# EAGLE schematic SteppyMk2 (EAGLE 9.2.2)
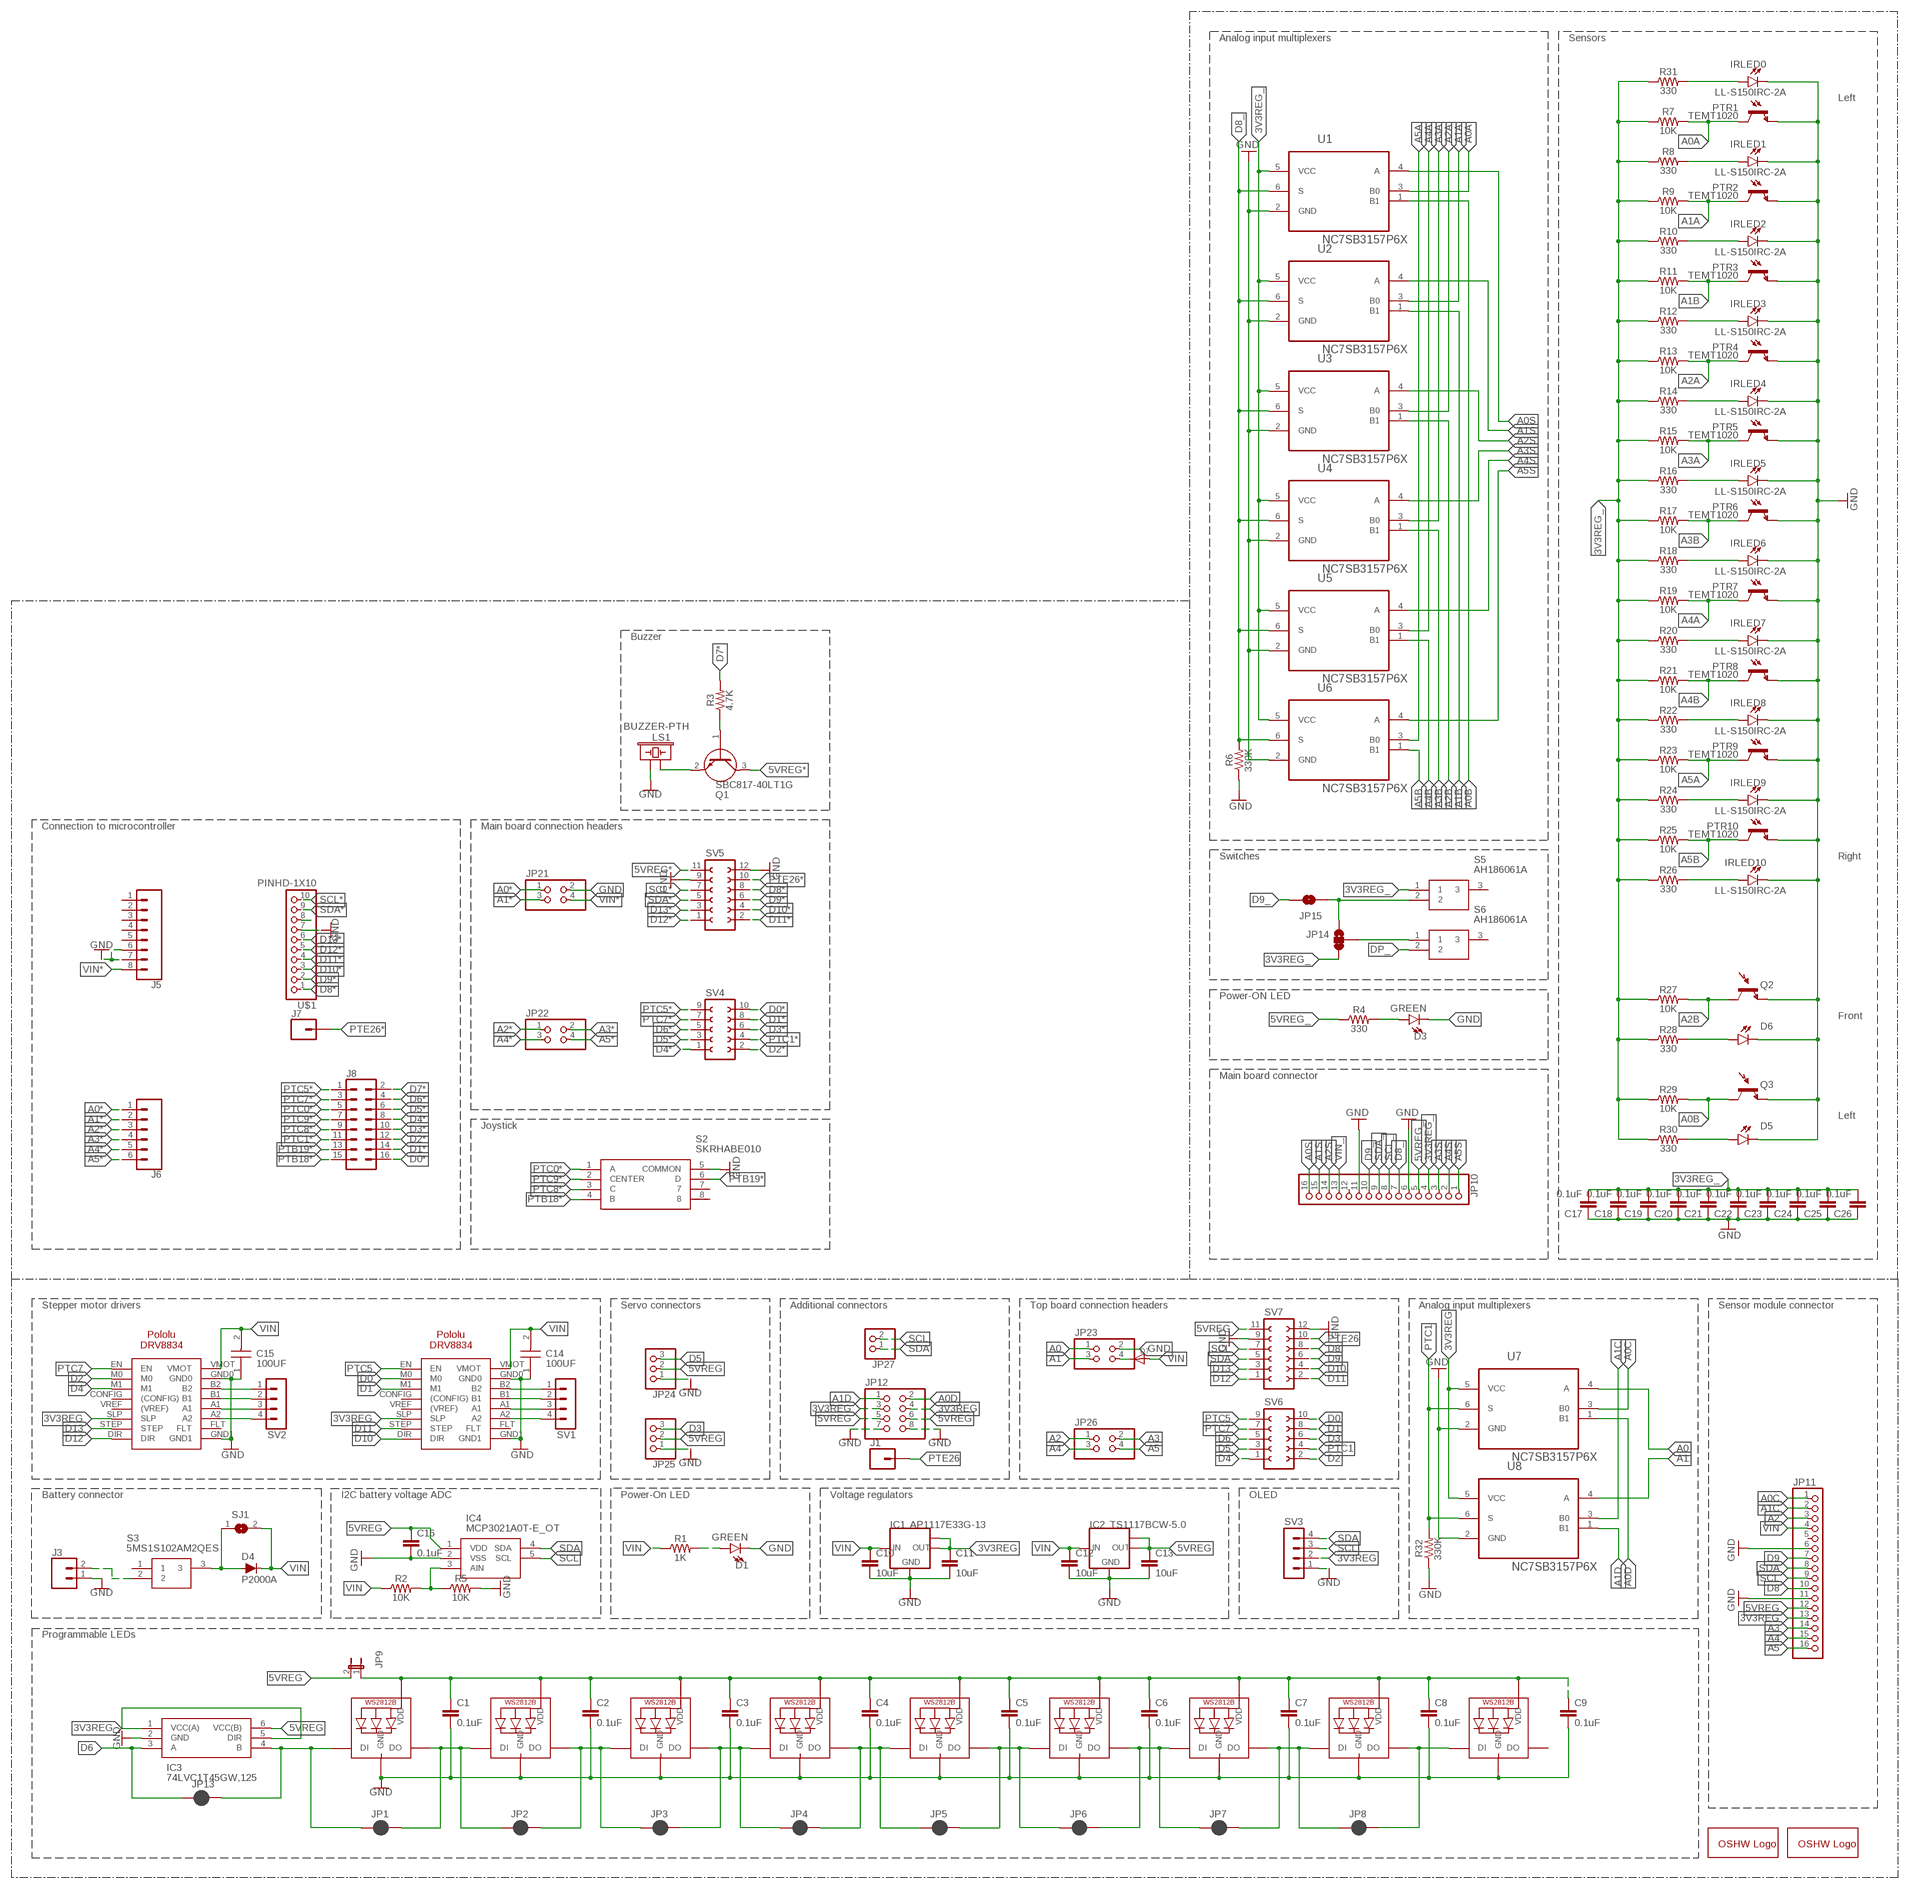
[diagram p0: schematic, sheet 1]

## Parts
C1  0.1uF  0.1UF-0603-25V-5%  [0603]
C2  0.1uF  0.1UF-0603-25V-5%  [0603]
C3  0.1uF  0.1UF-0603-25V-5%  [0603]
C4  0.1uF  0.1UF-0603-25V-5%  [0603]
C5  0.1uF  0.1UF-0603-25V-5%  [0603]
C6  0.1uF  0.1UF-0603-25V-5%  [0603]
C7  0.1uF  0.1UF-0603-25V-5%  [0603]
C8  0.1uF  0.1UF-0603-25V-5%  [0603]
C9  0.1uF  0.1UF-0603-25V-5%  [0603]
C10  10uF  10UF-0805-10V-10%  [0805]
C11  10uF  10UF-0805-10V-10%  [0805]
C12  10uF  10UF-0805-10V-10%  [0805]
C13  10uF  10UF-0805-10V-10%  [0805]
C14  100UF  EEEFK1C101P  [CAPM7058X610N]
C15  100UF  EEEFK1C101P  [CAPM7058X610N]
C16  0.1uF  0.1UF-0603-25V-5%  [0603]
C17  0.1uF  0.1UF-0603-25V-5%  [0603]
C18  0.1uF  0.1UF-0603-25V-5%  [0603]
C19  0.1uF  0.1UF-0603-25V-5%  [0603]
C20  0.1uF  0.1UF-0603-25V-5%  [0603]
C21  0.1uF  0.1UF-0603-25V-5%  [0603]
C22  0.1uF  0.1UF-0603-25V-5%  [0603]
C23  0.1uF  0.1UF-0603-25V-5%  [0603]
C24  0.1uF  0.1UF-0603-25V-5%  [0603]
C25  0.1uF  0.1UF-0603-25V-5%  [0603]
C26  0.1uF  0.1UF-0603-25V-5%  [0603]
CONLEFT  POLOLU-DRV8825  [POLOLU-DRV8825]
D1  GREEN  LED-GREEN1206  [LED-1206]
D3  GREEN  LED-GREEN1206  [LED-1206]
D4  P2000A  DIODE-PTH  [DIODE-1N4001]
D5  LED-IRSIDE_EMITTER  [LTE-302]
D6  LED-IRSIDE_EMITTER  [LTE-302]
D7  DIODESMA  [SMADIODE]
GOLD_ORB_SM1  OSHWLOGOLOGO8MM  [OSHW_8MM]
GOLD_ORB_SM2  OSHWLOGOLOGO5MM  [OSHW_5MM]
IC1  AP1117E33G-13  LM1117IMPX-3.3  [SOT223]
IC2  TS1117BCW-5.0  LM1117IMPX-5.0  [SOT223]
IC3  74LVC1T45GW,125  [SOT65P210X110-6N]
IC4  MCP3021A0T-E_OT  [SOT95P280X145-5N]
IRLED0  LL-S150IRC-2A  PT15-21C_TR8  [LEDC3215X130N]
IRLED1  LL-S150IRC-2A  PT15-21C_TR8  [LEDC3215X130N]
IRLED2  LL-S150IRC-2A  PT15-21C_TR8  [LEDC3215X130N]
IRLED3  LL-S150IRC-2A  PT15-21C_TR8  [LEDC3215X130N]
IRLED4  LL-S150IRC-2A  PT15-21C_TR8  [LEDC3215X130N]
IRLED5  LL-S150IRC-2A  PT15-21C_TR8  [LEDC3215X130N]
IRLED6  LL-S150IRC-2A  PT15-21C_TR8  [LEDC3215X130N]
IRLED7  LL-S150IRC-2A  PT15-21C_TR8  [LEDC3215X130N]
IRLED8  LL-S150IRC-2A  PT15-21C_TR8  [LEDC3215X130N]
IRLED9  LL-S150IRC-2A  PT15-21C_TR8  [LEDC3215X130N]
IRLED10  LL-S150IRC-2A  PT15-21C_TR8  [LEDC3215X130N]
J1  CONN_01  [1X01]
J3  CONN_02  [1X02]
J5  CONN_08"  [1X08]
J6  CONN_06SILK_FEMALE_PTH  [1X06]
J7  CONN_01  [1X01]
J8  CONN_08X2_HEADER  [2X8]
JP1  JUMPER-SMT_2_NC_PASTE_SILK  [SMT-JUMPER_2_NC_PASTE_SILK]
JP2  JUMPER-SMT_2_NC_PASTE_SILK  [SMT-JUMPER_2_NC_PASTE_SILK]
JP3  JUMPER-SMT_2_NC_PASTE_SILK  [SMT-JUMPER_2_NC_PASTE_SILK]
JP4  JUMPER-SMT_2_NC_PASTE_SILK  [SMT-JUMPER_2_NC_PASTE_SILK]
JP5  JUMPER-SMT_2_NC_PASTE_SILK  [SMT-JUMPER_2_NC_PASTE_SILK]
JP6  JUMPER-SMT_2_NC_PASTE_SILK  [SMT-JUMPER_2_NC_PASTE_SILK]
JP7  JUMPER-SMT_2_NC_PASTE_SILK  [SMT-JUMPER_2_NC_PASTE_SILK]
JP8  JUMPER-SMT_2_NC_PASTE_SILK  [SMT-JUMPER_2_NC_PASTE_SILK]
JP9  JP1E  [JP1]
JP10  PINHD-1X16/90  [1X16/90]
JP11  PINHD-1X16  [1X16]
JP12  PINHD-2X4  [2X04]
JP13  JUMPER-SMT_2_NC_PASTE_SILK  [SMT-JUMPER_2_NC_PASTE_SILK]
JP14  JUMPER-SMT_3_1-NC_TRACE_SILK  [SMT-JUMPER_3_1-NC_TRACE_SILK]
JP15  JUMPER-SMT_2_NC_TRACE_SILK  [SMT-JUMPER_2_NC_TRACE_SILK]
JP21  PINHD-2X2  [2X02]
JP22  PINHD-2X2  [2X02]
JP23  PINHD-2X2  [2X02]
JP24  PINHD-1X3  [1X03]
JP25  PINHD-1X3  [1X03]
JP26  PINHD-2X2  [2X02]
JP27  PINHD-1X2  [1X02]
LED1  WS2812B3535  [LED3535]
LED2  WS2812B3535  [LED3535]
LED3  WS2812B3535  [LED3535]
LED4  WS2812B3535  [LED3535]
LED5  WS2812B3535  [LED3535]
LED6  WS2812B3535  [LED3535]
LED7  WS2812B3535  [LED3535]
LED8  WS2812B3535  [LED3535]
LED9  WS2812B3535  [LED3535]
LS1  BUZZER-PTH  [BUZZER-12MM]
PTR1  TEMT1020  [TEMT1020]
PTR2  TEMT1020  [TEMT1020]
PTR3  TEMT1020  [TEMT1020]
PTR4  TEMT1020  [TEMT1020]
PTR5  TEMT1020  [TEMT1020]
PTR6  TEMT1020  [TEMT1020]
PTR7  TEMT1020  [TEMT1020]
PTR8  TEMT1020  [TEMT1020]
PTR9  TEMT1020  [TEMT1020]
PTR10  TEMT1020  [TEMT1020]
Q1  SBC817-40LT1G  [SOT96P237X111-3N]
Q2  LTR-301  [LTR-301]
Q3  LTR-301  [LTR-301]
R1  1K  RESISTOR0805  [0805]
R2  10K  RESISTOR0805  [0805]
R3  4.7K  RESISTOR0805  [0805]
R4  330  RESISTOR0805  [0805]
R5  10K  RESISTOR0805  [0805]
R6  330K  RESISTOR0805  [0805]
R7  10K  RESISTOR0805  [0805]
R8  330  RESISTOR0805  [0805]
R9  10K  RESISTOR0805  [0805]
R10  330  RESISTOR0805  [0805]
R11  10K  RESISTOR0805  [0805]
R12  330  RESISTOR0805  [0805]
R13  10K  RESISTOR0805  [0805]
R14  330  RESISTOR0805  [0805]
R15  10K  RESISTOR0805  [0805]
R16  330  RESISTOR0805  [0805]
R17  10K  RESISTOR0805  [0805]
R18  330  RESISTOR0805  [0805]
R19  10K  RESISTOR0805  [0805]
R20  330  RESISTOR0805  [0805]
R21  10K  RESISTOR0805  [0805]
R22  330  RESISTOR0805  [0805]
R23  10K  RESISTOR0805  [0805]
R24  330  RESISTOR0805  [0805]
R25  10K  RESISTOR0805  [0805]
R26  330  RESISTOR0805  [0805]
R27  10K  RESISTOR0805  [0805]
R28  330  RESISTOR0805  [0805]
R29  10K  RESISTOR0805  [0805]
R30  330  RESISTOR0805  [0805]
R31  330  RESISTOR0805  [0805]
R32  330K  RESISTOR0805  [0805]
S2  SKRHABE010  [SKRHABE010]
S3  5MS1S102AM2QES  [5MS1S102AM2QES]
S5  AH186061A  [AH186061A]
S6  AH186061A  [AH186061A]
SJ1  SJW  [SJW]
SV1  MA04-1  [MA04-1]
SV2  MA04-1  [MA04-1]
SV3  MA04-1  [MA04-1]
SV4  FE05-2  [FE05-2]
SV5  FE06-2  [FE06-2]
SV6  FE05-2  [FE05-2]
SV7  FE06-2  [FE06-2]
U1  NC7SB3157P6X  [SOT65P210X110-6N]
U2  NC7SB3157P6X  [SOT65P210X110-6N]
U3  NC7SB3157P6X  [SOT65P210X110-6N]
U4  NC7SB3157P6X  [SOT65P210X110-6N]
U5  NC7SB3157P6X  [SOT65P210X110-6N]
U6  NC7SB3157P6X  [SOT65P210X110-6N]
U7  NC7SB3157P6X  [SOT65P210X110-6N]
U8  NC7SB3157P6X  [SOT65P210X110-6N]
U$1  PINHD-1X10  [1X10-BIG]
U$2  POLOLU-DRV8825  [POLOLU-DRV8825]

## Nets
3V3REG: C11.1 CONLEFT.SLP IC1.2(OUT) IC1.TAB(OUT1) IC3.1(VCC(A)) IC3.5(DIR) JP11.13 JP12.3 JP12.4 SV3.2 U7.5(VCC) U8.5(VCC) U$2.SLP
3V3REG_: C17.2 C18.2 C19.2 C20.2 C21.2 C22.2 C23.2 C24.2 C25.2 C26.2 JP10.4 JP14.3 R7.1 R8.1 R9.1 R10.1 R11.1 R12.1 R13.1 R14.1 R15.1 R16.1 R17.1 R18.1 R19.1 R20.1 R21.1 R22.1 R23.1 R24.1 R25.1 R26.1 R27.1 R28.1 R29.1 R30.1 R31.1 S5.1 U1.5(VCC) U2.5(VCC) U3.5(VCC) U4.5(VCC) U5.5(VCC) U6.5(VCC)
5VREG: C13.1 C16.1 IC2.2(OUT) IC2.TAB(OUT1) IC3.6(VCC(B)) IC4.1(VDD) JP9.2 JP11.12 JP12.5 JP12.6 JP24.2 JP25.2 SV7.11
5VREG*: Q1.3(C) SV5.11
5VREG_: JP10.5 R4.1
A0: JP23.1 U7.4(A)
A0*: J6.1 JP21.1
A0A: PTR1.1(C) R7.2 U1.3(B0)
A0B: Q3.C(C1) R29.2 U1.1(B1)
A0C: JP11.1 U7.3(B0)
A0D: JP12.2 U7.1(B1)
A0S: JP10.16 U1.4(A)
A1: JP23.3 U8.4(A)
A1*: J6.2 JP21.3
A1A: PTR2.1(C) R9.2 U2.3(B0)
A1B: PTR3.1(C) R11.2 U2.1(B1)
A1C: JP11.2 U8.3(B0)
A1D: JP12.1 U8.1(B1)
A1S: JP10.15 U2.4(A)
A2: JP11.3 JP26.1
A2*: J6.3 JP22.1
A2A: PTR4.1(C) R13.2 U3.3(B0)
A2B: Q2.C(C1) R27.2 U3.1(B1)
A2S: JP10.14 U3.4(A)
A3: JP11.14 JP26.2
A3*: J6.4 JP22.2
A3A: PTR5.1(C) R15.2 U4.3(B0)
A3B: PTR6.1(C) R17.2 U4.1(B1)
A3S: JP10.3 U4.4(A)
A4: JP11.15 JP26.3
A4*: J6.5 JP22.3
A4A: PTR7.1(C) R19.2 U5.3(B0)
A4B: PTR8.1(C) R21.2 U5.1(B1)
A4S: JP10.2 U5.4(A)
A5: JP11.16 JP26.4
A5*: J6.6 JP22.4
A5A: PTR9.1(C) R23.2 U6.3(B0)
A5B: PTR10.1(C) R25.2 U6.1(B1)
A5S: JP10.1 U6.4(A)
D0: SV6.10 U$2.M0
D0*: J8.16 SV4.10
D1: SV6.8 U$2.M1
D1*: J8.14 SV4.8
D2: CONLEFT.M0 SV6.2
D2*: J8.12 SV4.2
D3: JP25.3 SV6.6
D3*: J8.10 SV4.6
D4: CONLEFT.M1 SV6.1
D4*: J8.8 SV4.1
D5: JP24.3 SV6.3
D5*: J8.6 SV4.3
D6: IC3.3(A) JP13.1 SV6.5
D6*: J8.4 SV4.5
D7*: J8.2 R3.2
D8: JP11.10 SV7.8
D8*: SV5.8 U$1.1
D8_: JP10.7 R6.2 U1.6(S) U2.6(S) U3.6(S) U4.6(S) U5.6(S) U6.6(S)
D9: JP11.7 SV7.6
D9*: SV5.6 U$1.2
D9_: JP10.10 JP15.1
D10: SV7.4 U$2.DIR
D10*: SV5.4 U$1.3
D11: SV7.2 U$2.STEP
D11*: SV5.2 U$1.4
D12: CONLEFT.DIR SV7.1
D12*: SV5.1 U$1.5
D13: CONLEFT.STEP SV7.3
D13*: SV5.3 U$1.6
DP_: S6.2
GND: C1.2 C2.2 C3.2 C4.2 C5.2 C6.2 C7.2 C8.2 C9.2 C10.2 C11.2 C12.2 C13.2 C14.1 C15.1 C16.2 C17.1 C18.1 C19.1 C20.1 C21.1 C22.1 C23.1 C24.1 C25.1 C26.1 CONLEFT.GND0 CONLEFT.GND1 D1.C D3.C D5.C D6.C IC1.1(GND) IC2.1(GND) IC3.2(GND) IC4.2(VSS) IRLED0.2(C) IRLED1.2(C) IRLED2.2(C) IRLED3.2(C) IRLED4.2(C) IRLED5.2(C) IRLED6.2(C) IRLED7.2(C) IRLED8.2(C) IRLED9.2(C) IRLED10.2(C) J3.1 J5.6 J5.7 JP10.6 JP10.11 JP11.6 JP11.11 JP12.7 JP12.8 JP21.2 JP23.2 JP24.1 JP25.1 LED1.4(GND) LED2.4(GND) LED3.4(GND) LED4.4(GND) LED5.4(GND) LED6.4(GND) LED7.4(GND) LED8.4(GND) LED9.4(GND) LS1.- PTR1.2(E) PTR2.2(E) PTR3.2(E) PTR4.2(E) PTR5.2(E) PTR6.2(E) PTR7.2(E) PTR8.2(E) PTR9.2(E) PTR10.2(E) Q2.E(E1) Q3.E(E1) R5.2 R6.1 R32.1 S2.5(COMMON) SV3.1 SV5.9 SV5.12 SV7.9 SV7.12 U1.2(GND) U2.2(GND) U3.2(GND) U4.2(GND) U5.2(GND) U6.2(GND) U7.2(GND) U8.2(GND) U$1.7 U$2.GND0 U$2.GND1
N$1: IRLED8.1(A) R22.2
N$2: IRLED1.1(A) R8.2
N$3: D6.A R28.2
N$4: D7.C JP23.4
N$5: JP14.2 S6.1
N$6: IRLED0.1(A) R31.2
N$7: IC3.4(B) JP1.1 JP13.2 LED1.1(DI)
N$8: JP2.2 JP3.1 LED2.3(DO) LED3.1(DI)
N$9: JP3.2 JP4.1 LED3.3(DO) LED4.1(DI)
N$10: JP4.2 JP5.1 LED4.3(DO) LED5.1(DI)
N$11: JP5.2 JP6.1 LED5.3(DO) LED6.1(DI)
N$12: JP6.2 JP7.1 LED6.3(DO) LED7.1(DI)
N$13: IRLED2.1(A) R10.2
N$14: JP7.2 JP8.1 LED7.3(DO) LED8.1(DI)
N$15: JP8.2 LED8.3(DO) LED9.1(DI)
N$16: D1.A R1.2
N$17: SV1.1 U$2.B2
N$18: SV1.2 U$2.B1
N$19: SV1.3 U$2.A1
N$20: SV1.4 U$2.A2
N$21: D5.A R30.2
N$23: D3.A R4.2
N$24: IRLED3.1(A) R12.2
N$25: U$1.8
N$27: CONLEFT.B2 SV2.1
N$28: CONLEFT.B1 SV2.2
N$29: CONLEFT.A1 SV2.3
N$30: CONLEFT.A2 SV2.4
N$31: J3.2 S3.2
N$33: LS1.+ Q1.2(E)
N$34: Q1.1(B) R3.1
N$35: IC4.3(AIN) R2.2 R5.1
N$45: C1.1 C2.1 C3.1 C4.1 C5.1 C6.1 C7.1 C8.1 C9.1 JP9.1 LED1.2(VDD) LED2.2(VDD) LED3.2(VDD) LED4.2(VDD) LED5.2(VDD) LED6.2(VDD) LED7.2(VDD) LED8.2(VDD) LED9.2(VDD)
N$47: IRLED4.1(A) R14.2
N$51: IRLED5.1(A) R16.2
N$55: IRLED6.1(A) R18.2
N$59: IRLED7.1(A) R20.2
N$68: IRLED9.1(A) R24.2
N$69: JP14.1 JP15.2 S5.2
N$73: IRLED10.1(A) R26.2
N$85: JP1.2 JP2.1 LED1.3(DO) LED2.1(DI)
N$86: D4.A S3.3 SJ1.1
PTB18*: J8.15 S2.4(B)
PTB19*: J8.13 S2.6(D)
PTC0*: J8.5 S2.1(A)
PTC1: R32.2 SV6.4 U7.6(S) U8.6(S)
PTC1*: J8.11 SV4.4
PTC5: SV6.9 U$2.EN
PTC5*: J8.1 SV4.9
PTC7: CONLEFT.EN SV6.7
PTC7*: J8.3 SV4.7
PTC8*: J8.9 S2.3(C)
PTC9*: J8.7 S2.2(CENTER)
PTE26: J1.1 SV7.10
PTE26*: J7.1 SV5.10
SCL: IC4.5(SCL) JP11.9 JP27.2 SV3.3 SV7.7
SCL*: SV5.7 U$1.10
SCL_: JP10.8
SDA: IC4.4(SDA) JP11.8 JP27.1 SV3.4 SV7.5
SDA*: SV5.5 U$1.9
SDA_: JP10.9
VIN: C10.1 C12.1 C14.2 C15.2 CONLEFT.VMOT D4.C D7.A IC1.3(IN) IC2.3(IN) JP11.4 R1.1 R2.1 SJ1.2 U$2.VMOT
VIN*: J5.8 JP21.4
VIN_: JP10.13
Unconnected: CONLEFT.CONFIG((CONFIG)) CONLEFT.FLT CONLEFT.VREF((VREF)) J5.1 J5.2 J5.3 J5.4 J5.5 JP10.12 JP11.5 LED9.3(DO) S2.7 S2.8 S3.1 S5.3 S6.3 U$2.CONFIG((CONFIG)) U$2.FLT U$2.VREF((VREF))

## Notes on the sheet
- Analog input multiplexers | Sensors
- Left
- Buzzer
- Connection to microcontroller | Main board connection headers
- Switches | Right
- Power-ON LED
- Front
- Main board connector
- Left
- Joystick
- Stepper motor drivers | Servo connectors | Additional connectors | Top board connection headers | Analog input multiplexers | Sensor module connector
- Battery connector | I2C battery voltage ADC | Power-On LED | Voltage regulators | OLED
- Programmable LEDs

## Library data of the parts
C1-C9 C16-C26 = SparkFun-Capacitors:0.1UF: 0.1µF ceramic capacitors A capacitor is a passive two-terminal electrical component used to store electrical energy temporarily in an electric field.; PROD_ID: CAP-08604
C10-C13 = SparkFun-Capacitors:10UF: 10.0µF ceramic capacitors A capacitor is a passive two-terminal electrical component used to store electrical energy temporarily in an electric field.; PROD_ID: CAP-11330
C14 C15 = EEEFK1C101P:EEEFK1C101P: Ecap 100uF 16V D case Panasonic 100uF 16 V dc Aluminium Electrolytic Capacitor, FK SMD Series 2000h 6.3 Dia. x 5.8mm Source: Datasheet <http://uk.rs-online.com/web/p/products/5370433>; ALLIED_NUMBER: 70256494; ALLIED_PRICE-STOCK: https://www.alliedelec.com/panasonic-eee-fk1c101p/70256494/; DESCRIPTION: Ecap 100uF 16V D case Panasonic 100uF 16 V dc Aluminium Electrolytic Capacitor, FK SMD Series 2000h 6.3 Dia. x 5.8mm; HEIGHT: 6.1mm; MANUFACTURER_NAME: Panasonic; MANUFACTURER_PART_NUMBER: EEEFK1C101P; RS_PART_NUMBER: 5370433P; RS_PRICE-STOCK: http://uk.rs-online.com/web/p/products/5370433P
CONLEFT U$2 = alvarop-lib:POLOLU-DRV8825
D1 D3 = SparkFun-LED:LED-GREEN: Green SMD LED Used in manufacturing of various products at SparkFun Packages: 0603 - SMD 0603 package [Product Link] <http://www.futureelectronics.com/en/technologies/semiconductors/optoelectronics/leds/Pages/9894312-LTST-C190GKT.aspx?CrossPart=HSMG-C190&IM=0> LilyPad 1206 - SMD1206 LilyPad package [Product Link] <http://www.futureelectronics.com/en/Technologies/Product.aspx?ProductID=IN150NGHARVATEKCORPORATION2049943&IM=0> 1206 - SMD1206 package [Product Link] <http://www.futureelectronics.com/en/technologies/semiconductors/optoelectronics/leds/Pages/8315665-LTST-C150KGKT.aspx?IM=0> 1206 Bottom Mount -SMD 1206 Bottom Mount [Product Link] <http://www.digikey.com/product-detail/en/lite-on-inc/LTST-C230KGKT/160-1456-1-ND/386854> SparkFun Products: Pro Mini 328 -5V <https://www.sparkfun.com/products/821> RedBoard <https://www.sparkfun.com/products/12757> MP3 Trigger <https://www.sparkfun.com/products/13720> Makey Makey <https://www.sparkfun.com/products/11076>; PROD_ID: DIO-00862
D4 = SparkFun-DiscreteSemi:DIODE: Diode; PROD_ID: DIO-09176; VALUE: 1A/50V/1.1V
D5 D6 = SparkFun-LED:LED-IR: Infrared LED (IR) Wavelength: 940nm Packages: TSAL6100 LTE302 - Side firing. Check SparkFun-Sensors.lbr for the receiver SparkFun Products: ZX Distance and Gesture Sensor <[https://www.sparkfun.com/products/12780]> Infrared Emitters and Detectors <https://www.sparkfun.com/products/241>; PROD_ID: DIO-14163; SF_ID: SEN-00241
D7 = adafruit:DIODE: Diode
GOLD_ORB_SM1 GOLD_ORB_SM2 = oshw:OSHWLOGO: The OSHW logo for PCB layout
IC1 IC2 = lm1117:LM1117IMPX-*
IC3 = 74LVC1T45GW_125:74LVC1T45GW,125: NXP - 74LVC1T45GW,125 - TRANSCEIVER, 3 STATE, SOT-363-6 Source: Datasheet <https://componentsearchengine.com/Datasheets/2/74LVC1T45GW,125.pdf>; DESCRIPTION: NXP - 74LVC1T45GW,125 - TRANSCEIVER, 3 STATE, SOT-363-6; HEIGHT: 1.1mm; MANUFACTURER_NAME: Nexperia; MANUFACTURER_PART_NUMBER: 74LVC1T45GW,125; MOUSER_PART_NUMBER: 771-74LVC1T45GW125; MOUSER_PRICE-STOCK: https://www.mouser.com/Search/Refine.aspx?Keyword=771-74LVC1T45GW125; RS_PART_NUMBER: 8168791P; RS_PRICE-STOCK: http://befr.rs-online.com/web/p/products/8168791P
IC4 = MCP3021A0T-E_OT:MCP3021A0T-E_OT: MICROCHIP - MCP3021A0T-E/OT - ADC, AEC-Q100, SAR, 10BIT, SOT-23-5 Source: Datasheet <http://ww1.microchip.com/downloads/en/DeviceDoc/20001805C.pdf>; ALLIED_NUMBER: 70451980; ALLIED_PRICE-STOCK: https://www.alliedelec.com/microchip-technology-inc-mcp3021a0t-e-ot/70451980/; DESCRIPTION: MICROCHIP - MCP3021A0T-E/OT - ADC, AEC-Q100, SAR, 10BIT, SOT-23-5; HEIGHT: 1.45mm; MANUFACTURER_NAME: Microchip; MANUFACTURER_PART_NUMBER: MCP3021A0T-E/OT; MOUSER_PART_NUMBER: 579-MCP3021A0T-E/OT; MOUSER_PRICE-STOCK: https://www.mouser.com/Search/Refine.aspx?Keyword=579-MCP3021A0T-E%2FOT
IRLED0 IRLED1-IRLED10 = PT15-21C_TR8:PT15-21C_TR8: Phototransistors IR Phototransistor Source: Datasheet <http://www.everlight.com/file/ProductFile/PT15-21C-TR8.pdf>; DESCRIPTION: Phototransistors IR Phototransistor; HEIGHT: 1.3mm; MANUFACTURER_NAME: Everlight; MANUFACTURER_PART_NUMBER: PT15-21C/TR8; MOUSER_PART_NUMBER: 638-PT1521CTR8; MOUSER_PRICE-STOCK: https://www.mouser.com/Search/Refine.aspx?Keyword=638-PT1521CTR8
J1 J7 = SparkFun-Connectors:CONN_01: Single connection point. Often used as Generic Header-pin footprint for 0.1 inch spaced/style header connections On any of the 0.1 inch spaced packages, you can populate with these: Break Away Headers - Straight <https://www.sparkfun.com/products/116> (PRT-00116) Break Away Male Headers - Right Angle <https://www.sparkfun.com/products/553> (PRT-00553) Female Headers <https://www.sparkfun.com/products/115> (PRT-00115) Break Away Headers - Machine Pin <https://www.sparkfun.com/products/117> (PRT-00117) Break Away Female Headers - Swiss Machine Pin <https://www.sparkfun.com/products/743> (PRT-00743) This device is also useful as a general connection point to wire up your design to another part of your project. Our various solder wires solder well into these plated through hole pads. Hook-Up Wire - Assortment (Stranded, 22 AWG) <https://www.sparkfun.com/products/11375> (PRT-11375) Hook-Up Wire - Assortment (Solid Core, 22 AWG) <https://www.sparkfun.com/products/11367> (PRT-11367) View the entire wire category on our website here <https://www.sparkfun.com/categories/141> Special notes: SMTSO-256-ET is a "flush mount" nut for a 4-40 screw. We mostly use this on specialty testbeds; it is a nice way to connect hardware to your PCB at an adjustable hieght. Also note, the SNAP packages are for using a snappable style connector. We sell a baggie of snaps and they are also used on two LilyPad designs: Snap Assortment - 30 pack (male and female) <https://www.sparkfun.com/products/11347> (DEV-11347) LilyPad Arduino SimpleSnap <https://www.sparkfun.com/products/10941> (DEV-10941) LilyPad SimpleSnap Protoboard <https://www.sparkfun.com/products/10940> (DEV-10940)
J3 = SparkFun-Connectors:CONN_02: Multi connection point. Often used as Generic Header-pin footprint for 0.1 inch spaced/style header connections On any of the 0.1 inch spaced packages, you can populate with these: Break Away Headers - Straight <https://www.sparkfun.com/products/116> (PRT-00116) Break Away Male Headers - Right Angle <https://www.sparkfun.com/products/553> (PRT-00553) Female Headers <https://www.sparkfun.com/products/115> (PRT-00115) Break Away Headers - Machine Pin <https://www.sparkfun.com/products/117> (PRT-00117) Break Away Female Headers - Swiss Machine Pin <https://www.sparkfun.com/products/743> (PRT-00743) For SCREWTERMINALS and SPRING TERMINALS visit here: Screw Terimnals on SparkFun.com <https://www.sparkfun.com/search/results?term=Screw+Terminals> (5mm/3.5mm/2.54mm spacing) This device is also useful as a general connection point to wire up your design to another part of your project. Our various solder wires solder well into these plated through hole pads. Hook-Up Wire - Assortment (Stranded, 22 AWG) <https://www.sparkfun.com/products/11375> (PRT-11375) Hook-Up Wire - Assortment (Solid Core, 22 AWG) <https://www.sparkfun.com/products/11367> (PRT-11367) View the entire wire category on our website here <https://www.sparkfun.com/categories/141> Special notes: Molex polarized connector foot print use with: PRT-08233 with associated crimp pins and housings. 2.54_SCREWTERM for use with PRT-10571. 3.5mm Screw Terminal footprints for PRT-08084 5mm Screw Terminal footprints for use with PRT-08432
J5 = SparkFun-Connectors:CONN_08: Multi connection point. Often used as Generic Header-pin footprint for 0.1 inch spaced/style header connections On any of the 0.1 inch spaced packages, you can populate with these: Break Away Headers - Straight <https://www.sparkfun.com/products/116> (PRT-00116) Break Away Male Headers - Right Angle <https://www.sparkfun.com/products/553> (PRT-00553) Female Headers <https://www.sparkfun.com/products/115> (PRT-00115) Break Away Headers - Machine Pin <https://www.sparkfun.com/products/117> (PRT-00117) Break Away Female Headers - Swiss Machine Pin <https://www.sparkfun.com/products/743> (PRT-00743) Arduino Stackable Header - 8 Pin <https://www.sparkfun.com/products/9279> (PRT-09279) For SCREWTERMINALS and SPRING TERMINALS visit here: Screw Terimnals on SparkFun.com <https://www.sparkfun.com/search/results?term=Screw+Terminals> (5mm/3.5mm/2.54mm spacing) This device is also useful as a general connection point to wire up your design to another part of your project. Our various solder wires solder well into these plated through hole pads. Hook-Up Wire - Assortment (Stranded, 22 AWG) <https://www.sparkfun.com/products/11375> (PRT-11375) Hook-Up Wire - Assortment (Solid Core, 22 AWG) <https://www.sparkfun.com/products/11367> (PRT-11367) View the entire wire category on our website here <https://www.sparkfun.com/categories/141> Special notes: Molex polarized connector foot print use with SKU : PRT-08231 with associated crimp pins and housings. 1MM SMD Version SKU: PRT-10208 NOTES ON THE VARIANTS LOCK and LOCK_LONGPADS... This footprint was designed to help hold the alignment of a through-hole component (i.e. 6-pin header) while soldering it into place. You may notice that each hole has been shifted either up or down by 0.005 of an inch from it's more standard position (which is a perfectly straight line). This slight alteration caused the pins (the squares in the middle) to touch the edges of the holes. Because they are alternating, it causes a "brace" to hold the component in place. 0.005 has proven to be the perfect amount of "off-center" position when using our standard breakaway headers. Although looks a little odd when you look at the bare footprint, once you have a header in there, the alteration is very hard to notice. Also,if you push a header all the way into place, it is covered up entirely on the bottom side.; PROD_ID: CONN-08438
J6 = SparkFun-Connectors:CONN_06: Multi connection point. Often used as Generic Header-pin footprint for 0.1 inch spaced/style header connections On any of the 0.1 inch spaced packages, you can populate with these: Break Away Headers - Straight <https://www.sparkfun.com/products/116> (PRT-00116) Break Away Male Headers - Right Angle <https://www.sparkfun.com/products/553> (PRT-00553) Female Headers <https://www.sparkfun.com/products/115> (PRT-00115) Break Away Headers - Machine Pin <https://www.sparkfun.com/products/117> (PRT-00117) Break Away Female Headers - Swiss Machine Pin <https://www.sparkfun.com/products/743> (PRT-00743) Arduino Stackable Header - 6 Pin <https://www.sparkfun.com/products/9280> (PRT-09280) For SCREWTERMINALS and SPRING TERMINALS visit here: Screw Terimnals on SparkFun.com <https://www.sparkfun.com/search/results?term=Screw+Terminals> (5mm/3.5mm/2.54mm spacing) This device is also useful as a general connection point to wire up your design to another part of your project. Our various solder wires solder well into these plated through hole pads. Hook-Up Wire - Assortment (Stranded, 22 AWG) <https://www.sparkfun.com/products/11375> (PRT-11375) Hook-Up Wire - Assortment (Solid Core, 22 AWG) <https://www.sparkfun.com/products/11367> (PRT-11367) View the entire wire category on our website here <https://www.sparkfun.com/categories/141>; PROD_ID: CONN-08437
J8 = SparkFun-Connectors:CONN_08X2: Multi connection point. Often used as Generic Header-pin footprint for 0.1 inch spaced/style header connections You can populate with any combo of single row headers, but if you'd like an exact match, check this: Header - 2x8 (Male, 0.1") <https://www.sparkfun.com/products/13156> (PRT-13156) On any of the 0.1 inch spaced packages, you can populate with these: Break Away Headers - Straight <https://www.sparkfun.com/products/116> (PRT-00116) Break Away Male Headers - Right Angle <https://www.sparkfun.com/products/553> (PRT-00553) Female Headers <https://www.sparkfun.com/products/115> (PRT-00115) Break Away Headers - Machine Pin <https://www.sparkfun.com/products/117> (PRT-00117) Break Away Female Headers - Swiss Machine Pin <https://www.sparkfun.com/products/743> (PRT-00743)
JP1-JP8 JP13 = SparkFun-Jumpers:JUMPER-SMT_2_NC_PASTE: Normally closed solder jumper This jumper has an aperture in the stencil to allow solder paste to bridge the split in the wire so it's normally closed (NC). Wick off the solder to open the connection. Reapply solder to reclose the connection.
JP9 = jumper:JP1E: JUMPER
JP10 JP11 = pinhead:PINHD-1X16: PIN HEADER
JP12 = adafruit:PINHD-2X4: PIN HEADER
JP14 = SparkFun-Jumpers:JUMPER-SMT_3_1-NC_TRACE: Normally closed trace jumper (1 of 2 connections) This jumper has a trace between two pads so it's normally closed (NC). The other connection is normally open (NO). Use a razor knife to open the connection. For best results follow the IPC guidelines for cutting traces: Cutout at least 0.063 mm (0.005 in). Remove all loose material to clean up the cut area. Seal the cut with an approved epoxy. Reapply solder to reclose the connection, or to close the NO connection.
JP15 = SparkFun-Jumpers:JUMPER-SMT_2_NC_TRACE: Normally closed trace jumper This jumper has a trace between two pads so it's normally closed (NC). Use a razor knife to open the connection. For best results follow the IPC guidelines for cutting traces: Cutout at least 0.063 mm (0.005 in). Remove all loose material to clean up the cut area. Seal the cut with an approved epoxy. Reapply solder to reclose the connection.
JP21-JP23 JP26 = pinhead:PINHD-2X2: PIN HEADER
JP24 JP25 = adafruit:PINHD-1X3: PIN HEADER
JP27 = pinhead:PINHD-1X2: PIN HEADER
LED1-LED9 = adafruit:WS2812B
LS1 = SparkFun-Electromechanical:BUZZER: Buzzer Small round buzzers that operate around the audible 2kHz range. You can use these as speakers to create simple music or user interfaces. Variant Overview: PTH - Mini Speaker - PC Mount 12mm 2.048kHz <https://www.sparkfun.com/products/7950> PTH_KIT - Mini Speaker - PC Mount 12mm 2.048kHz <https://www.sparkfun.com/products/7950> KIT simplifies soldering by adding stop mask to one side of the pads. PTH_NO_SILK - Mini Speaker - PC Mount 12mm 2.048kHz <https://www.sparkfun.com/products/7950> No silkscreen indicator of buzzer outline. PTH_KIT_NO_SILK - Mini Speaker - PC Mount 12mm 2.048kHz <https://www.sparkfun.com/products/7950> KIT package w/o silkscreen SMD - Buzzer Audio Magnetic (CCV-084B16) SMD buzzer used on, e.g. the LilyPad Buzzer <https://www.sparkfun.com/products/8463> and RFID USB Reader <https://www.sparkfun.com/products/9963>. SMD_KIT - Buzzer Audio Magnetic (CCV-084B16) SMD Buzzer with elongated pins to make soldering easier. Used on the SparkFun Simon Says - Surface Mount Soldering Kit <https://www.sparkfun.com/products/10935>.; PROD_ID: COMP-08253; SF_SKU: COM-07950
PTR1-PTR10 = TEMD1020:TEMT1020: VISHAY - TEMD1020 - PHOTODIODE, 940NM, 15DEG, SMD Source: Datasheet <https://componentsearchengine.com/Datasheets/1/TEMD1020.pdf>; DESCRIPTION: VISHAY - TEMD1020 - PHOTODIODE, 940NM, 15DEG, SMD; HEIGHT: mm; MANUFACTURER_NAME: Vishay; MANUFACTURER_PART_NUMBER: TEMD1020; MOUSER_PART_NUMBER: 782-TEMD1020; MOUSER_PRICE-STOCK: https://www.mouser.com/Search/Refine.aspx?Keyword=782-TEMD1020; RS_PART_NUMBER: 1808105P; RS_PRICE-STOCK: http://uk.rs-online.com/web/p/products/1808105P
Q1 = SBC817-40LT1G:SBC817-40LT1G: NPN Bipolar Transistor, 500 mA 45 V, 3-pin SOT-23 Source: Datasheet <http://www.onsemi.com/pub/Collateral/BC817-16LT1-D.PDF>; ALLIED_NUMBER: 70300549; ALLIED_PRICE-STOCK: http://www.alliedelec.com/on-semiconductor-sbc817-40lt1g/70300549/; DESCRIPTION: NPN Bipolar Transistor, 500 mA 45 V, 3-pin SOT-23; HEIGHT: 1.11mm; MANUFACTURER_NAME: ON Semiconductor; MANUFACTURER_PART_NUMBER: SBC817-40LT1G; MOUSER_PART_NUMBER: 863-SBC817-40LT1G; MOUSER_PRICE-STOCK: https://www.mouser.com/Search/Refine.aspx?Keyword=863-SBC817-40LT1G; RS_PART_NUMBER: 1631159; RS_PRICE-STOCK: http://uk.rs-online.com/web/p/products/1631159
Q2 Q3 = SparkFun-Sensors:LTR-301: LiteOn LTR-301 IR Phototransistor (Side-Receiving) Side-looking Infrared detectors. These simple devices operate at 940nm and work well for generic IR systems including remote control and touch-less object sensing. Using a simple ADC on any microcontroller will allow variable readings to be collected from the detector. Datasheet <http://www.sparkfun.com/datasheets/Components/LTR-301.pdf> SparkFun Products Infrared Emitters and Detectors <https://www.sparkfun.com/products/241> (SEN-00241); PROD_ID: DIO-10904; SF_ID: SEN-00241
R1-R32 = SparkFun-Resistors:RESISTOR: Generic Resistor Package
S2 = SKRHABE010:SKRHABE010: Multi-Directional Switches 4-directn cntr push W/boss 200K Cycles Source: Datasheet <https://www.alps.com/prod/info/E/PDF/MultiControl/Switch/SKRH.pdf>; DESCRIPTION: Multi-Directional Switches 4-directn cntr push W/boss 200K Cycles; HEIGHT: 5mm; MANUFACTURER_NAME: ALPS; MANUFACTURER_PART_NUMBER: SKRHABE010; MOUSER_PART_NUMBER: 688-SKRHAB; MOUSER_PRICE-STOCK: https://www.mouser.com/Search/Refine.aspx?Keyword=688-SKRHAB
S3 = 5MS1S102AM2QES:5MS1S102AM2QES: Slide switch,SP,5.08 high PC thru-hole PCB Slide Switch SPDT On-On 5 A@ 28 V dc Top Source: Datasheet <http://docs-emea.rs-online.com/webdocs/13fb/0900766b813fbb35.pdf>; DESCRIPTION: Slide switch,SP,5.08 high PC thru-hole PCB Slide Switch SPDT On-On 5 A@ 28 V dc Top; HEIGHT: mm; MANUFACTURER_NAME: RS Components; MANUFACTURER_PART_NUMBER: 5MS1S102AM2QES; RS_PART_NUMBER: 7347292; RS_PRICE-STOCK: http://uk.rs-online.com/web/p/products/7347292
S5 S6 = AH186061A:AH186061A: Ultra-miniature Size Switch Source: Datasheet <http://www3.panasonic.biz/ac/e_download/control/switch/micro/catalog/sw_m_eng_ah1.pdf?f_cd=400052>; DESCRIPTION: Ultra-miniature Size Switch; HEIGHT: mm; MANUFACTURER_NAME: Panasonic; MANUFACTURER_PART_NUMBER: AH186061A
SJ1 = jumper:SJ: SMD solder JUMPER
SV1-SV3 = con-lstb:MA04-1: PIN HEADER; OC_FARNELL: unknown; OC_NEWARK: unknown
SV4 SV6 = con-lsta:FE05-2: FEMALE HEADER; OC_FARNELL: unknown; OC_NEWARK: unknown
SV5 SV7 = con-lsta:FE06-2: FEMALE HEADER; OC_FARNELL: unknown; OC_NEWARK: unknown
U1-U8 = NC7SB3157P6X:NC7SB3157P6X: SPDT Analog Switch; AVAILABILITY: Unavailable; DESCRIPTION: NC7SB3157 Series 1.65 to 5.5 V Multiplexer/Demultiplexer Bus Switch - SC-70-6; MF: ON Semiconductor; MP: NC7SB3157P6X; PACKAGE: SC-70-6 ON Semiconductor; PRICE: None
U$1 = adafruit:PINHD-1X10: Pin header 1x10 0.1" spacing With round pins